# Altium schematic sheet Power Supply.SchDoc
size A4
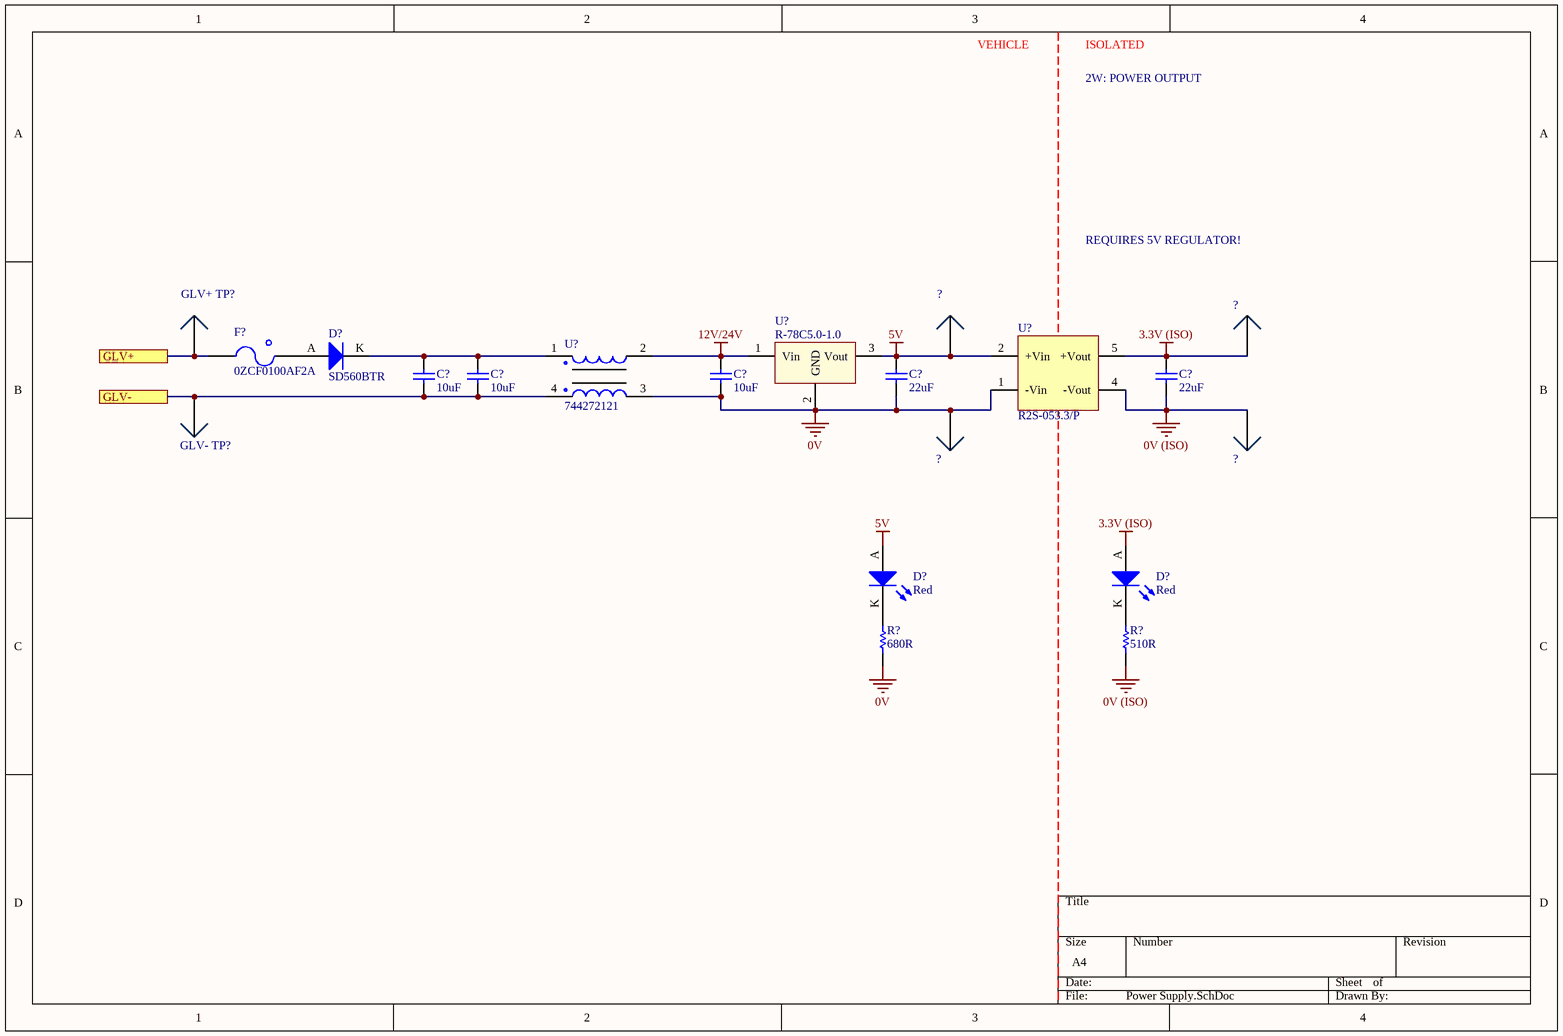
[diagram p0: Power Supply.SchDoc]

## Parts
(Parts that share a designator on the sheet are numbered #1, #2 ... from top to bottom, then left to right.)
?#1  0mm  [SMD Test Point]  (value not drawn)
?#2  0mm  [SMD Test Point]  (value not drawn)
?#3  0mm  [SMD Test Point]  (value not drawn)
?#4  0mm  [SMD Test Point]  (value not drawn)
C?#1  10uF  [0805]
C?#2  10uF  [0805]
C?#3  10uF  [0805]
C?#4  22uF  [1206]
C?#5  22uF  [1206]
D?#1  SD560BTR  [SMB Diode]
D?#2  Red  [0805 LED]
D?#3  Red  [0805 LED]
F?  0ZCF0100AF2A  [2920]
GLV+_TP?  0mm  [SMD Test Point]  (value not drawn)
GLV-_TP?  0mm  [SMD Test Point]  (value not drawn)
R?#1  680R  [0805]
R?#2  510R  [0805]
U?#1  R2S-053.3/P  [RECOM 8-SMD (5 Pin)]
U?#2  744272121  [Wurth 4-PC Pad]
U?#3  R-78C5.0-1.0  [RECOM 3-SIP]

## Ports
GLV+, GLV-

## Nets
0V: ?#3.1 C?#3.1 C?#4.1 R?#1.1 U?#1.1(-Vin) U?#2.3 U?#3.2(GND)
0V (ISO): ?#4.1 C?#5.1 R?#2.1 U?#1.4(-Vout)
3.3V (ISO): ?#2.1 C?#5.2 D?#3.A U?#1.5(+Vout)
5V: ?#1.1 C?#4.2 D?#2.A U?#1.2(+Vin) U?#3.3(Vout)
12V/24V: C?#3.2 U?#2.2 U?#3.1(Vin)
GLV+: F?.1 GLV+_TP?.1 ; port GLV+
GLV-: C?#1.1 C?#2.1 GLV-_TP?.1 U?#2.4 ; port GLV-
NetC?#1_2: C?#1.2 C?#2.2 D?#1.K U?#2.1
NetD?#1_A: D?#1.A F?.2
NetD?#2_K: D?#2.K R?#1.2
NetD?#3_K: D?#3.K R?#2.2

## Notes on the sheet
- VEHICLE
- ISOLATED
- 2W: POWER OUTPUT
- REQUIRES 5V REGULATOR!

## Library data of the parts
?#1-?#4 GLV+_TP? GLV-_TP? = SMD Test Point: Positions: 1; Row Spacing: 0; Flange: No; Contact: NA; Part Number: SMD Test Point; Pitch: 0mm; Angle: 0
C?#1-C?#3 = GRM21BR6YA106KE43L: Manufacturer: muRata; Tolerance: 10%; Material: X5R; Rated Voltage: 50V; Part Number: GRM21BR6YA106KE43L; Value: 10uF; Digikey Part Number: 490-10514-6-ND
C?#4 C?#5 = CC1206MKX5R7BB226: Manufacturer: YAGEO; Tolerance: 20%; Material: Ceramic; Rated Voltage: 16V; Part Number: CC1206MKX5R7BB226; Value: 22uF; Digikey Part Number: 311-1997-2-ND
D?#1 = SD560BTR: 1.2V_F 600V 5A SMB; Manufacturer: SMC Diode Solutions; Part Number: SD560BTR; Digikey Part Number: 1655-1530-2-ND; Digikey Link: https://www.digikey.com/product-detail/en/smc-diode-solutions/SD560BTR/1655-1530-2-ND/6022620
D?#2 D?#3 = SML-210LTT86: Red LED Indication - Discrete 1.75V 0805 (2012 Metric); Manufacturer: ROHM Semiconductor; Part Number: SML-210LTT86; Colour: Red; Digikey Part Number: 511-1286-1-ND; Digikey Link: https://www.digikey.com/product-detail/en/rohm-semiconductor/SML-210LTT86/511-1286-1-ND/637099
F? = 0ZCF0100AF2A: PTC RESET FUSE 60V 1A 292; Manufacturer: Littelfuse Inc.; Part Number: 0ZCF0100AF2A; Digikey Part Number: 507-2070-1-ND; Digikey Link: https://www.digikey.com/product-detail/en/bel-fuse-inc/0ZCF0100AF2A/507-2070-1-ND/6210547
R?#1 = RC0805FR07680RL: Manufacturer: YAGEO; Tolerance: 0.01; Rated Voltage: 0.125W; Part Number: RC0805FR07680RL; Value: 680R; Material: FR-07
R?#2 = RC0805FR07510RL: Manufacturer: YAGEO; Tolerance: 0.01; Rated Voltage: 0.125W; Part Number: RC0805FR07510RL; Value: 510R; Material: FR-07
U?#1 = R2S-053.3/P: Isolated Module DC DC Converter 1 Output 3.3V 606mA 4.5V - 5.5V Input; Manufacturer: Recom; Output Power: 2W; Efficiency: 0.75; Part Number: R2S-053.3/P; Input Voltage: 4.5V-5.5V; Output Voltage: 3.3V; Isolation: Isolated; Digikey Part Number: 945-2677-5-ND; Digikey Link: https://www.digikey.com/product-detail/en/recom-power/R2S-053.3-P/945-2677-5-ND/2302804
U?#2 = 744272121: 120µH @ 100kHz 2 Line Common Mode Choke Surface Mount 460 Ohms @ 30MHz 2.5A DCR 25mOhm; Manufacturer: Wurth Electronics Inc; Inductance: 120uH @ 100kHz; Part Number: 744272121; Impedence: 460 Ohms @ 30MHz; Material: Wirewound; Rated Current: 2.5A; Digikey Part Number: 732-1489-1-ND; Digikey Link: https://www.digikey.com/product-detail/en/w-rth-elektronik/744272121/732-1489-1-ND/1639501
U?#3 = R-78C5.0-1.0: CONV DC/DC 1A 5V OUT SIP VERT; Manufacturer: Recom; Isolation: Non-Isolated; Part Number: R-78C5.0-1.0; Digikey Part Number: 945-1395-5-ND; Digikey Link: https://www.digikey.com.au/product-detail/en/recom-power/R-78C5.0-1.0/945-1395-5-ND/2652148